# Altium schematic sheet Connectors#1.SchDoc
size A; SheetNumber: 8; SheetTotal: 9
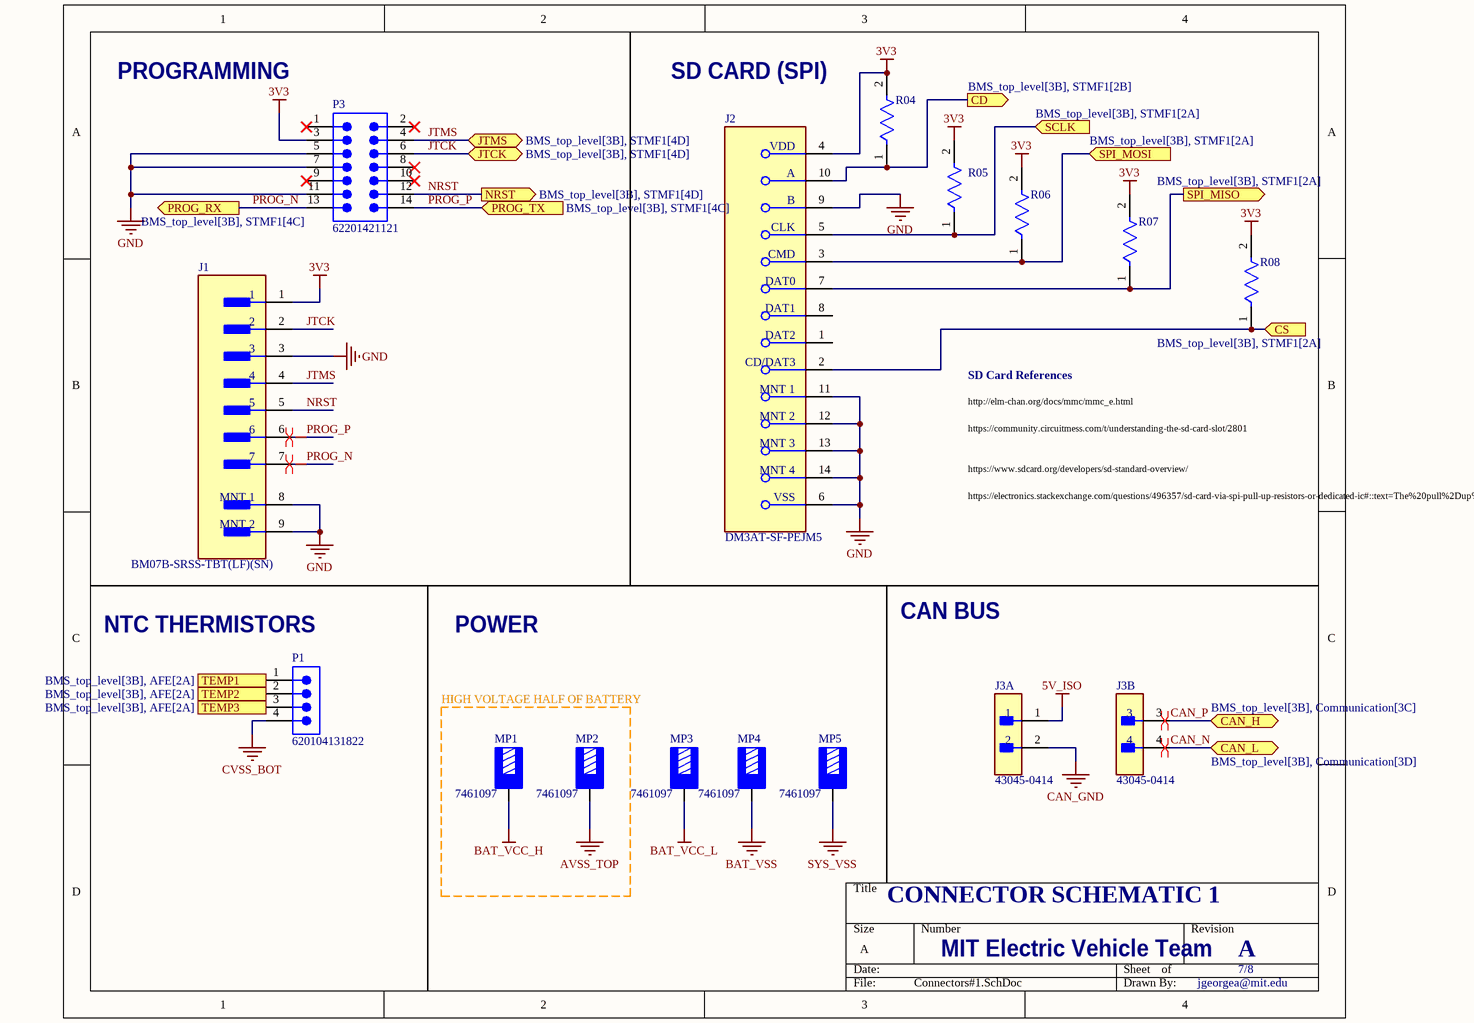
[diagram p0: Connectors#1.SchDoc]

## Parts
J1  BM07B-SRSS-TBT(LF)(SN)  [FP-BM07B-SRSS-TBT_LF_SN-MFG]
J2  DM3AT-SF-PEJM5  [FP-DM3AT-SF-PEJM5-MFG]
J3  43045-0414  [FP-43045-0414-MFG]  (parts A,B of 2)
MP1  7461097  [7461097_chemical surface]
MP2  7461097  [7461097_chemical surface]
MP3  7461097  [7461097_chemical surface]
MP4  7461097  [7461097_chemical surface]
MP5  7461097  [7461097_chemical surface]
P1  620104131822  [620104131822]
P3  62201421121  [62201421121]
R04  RC0603FR-0710KL  [FP-RC0603-0_55-IPC_C]  (value not drawn)
R05  RC0603FR-0710KL  [FP-RC0603-0_55-IPC_C]  (value not drawn)
R06  RC0603FR-0710KL  [FP-RC0603-0_55-IPC_C]  (value not drawn)
R07  RC0603FR-0710KL  [FP-RC0603-0_55-IPC_C]  (value not drawn)
R08  RC0603FR-0710KL  [FP-RC0603-0_55-IPC_C]  (value not drawn)

## Blocks framed on the sheet
HIGH VOLTAGE HALF OF BATTERY: MP1 MP2

## Ports
CAN_H (bidir, see BMS_top_level[3B], Communication[3C]), CAN_L (bidir, see BMS_top_level[3B], Communication[3D]), CD (out, see BMS_top_level[3B], STMF1[2B]), CS (in, see BMS_top_level[3B], STMF1[2A]), JTCK (bidir, see BMS_top_level[3B], STMF1[4D]), JTMS (bidir, see BMS_top_level[3B], STMF1[4D]), NRST (out, see BMS_top_level[3B], STMF1[4D]), PROG_RX (out, see BMS_top_level[3B], STMF1[4C]), PROG_TX (in, see BMS_top_level[3B], STMF1[4C]), SCLK (in, see BMS_top_level[3B], STMF1[2A]), SPI_MISO (out, see BMS_top_level[3B], STMF1[2A]), SPI_MOSI (in, see BMS_top_level[3B], STMF1[2A]), TEMP1 (out, see BMS_top_level[3B], AFE[2A]), TEMP2 (out, see BMS_top_level[3B], AFE[2A]), TEMP3 (out, see BMS_top_level[3B], AFE[2A])

## Nets
3V3: J1.1 J2.4(VDD) P3.3 R04.2 R05.2 R06.2 R07.2 R08.2
5V_ISO: J3.1
AVSS_TOP: MP2.1
BAT_VCC_H: MP1.1
BAT_VCC_L: MP3.1
BAT_VSS: MP4.1
CAN_GND: J3.2
CVSS_BOT: P1.4
GND: J1.3 J1.8(MNT_1) J1.9(MNT_2) J2.6(VSS) J2.9(B) J2.11(MNT_1) J2.12(MNT_2) J2.13(MNT_3) J2.14(MNT_4) P3.5 P3.7 P3.11
SYS_VSS: MP5.1
CAN_N: J3.4 ; port CAN_L
CAN_P: J3.3 ; port CAN_H
CD: J2.10(A) R04.1 ; port CD
CS: J2.2(CD/DAT3) R08.1 ; port CS
JTCK: J1.2 P3.6 ; port JTCK
JTMS: J1.4 P3.4 ; port JTMS
NRST: J1.5 P3.12 ; port NRST
PROG_N: J1.7 P3.13 ; port PROG_RX
PROG_P: J1.6 P3.14 ; port PROG_TX
SCLK: J2.5(CLK) R05.1 ; port SCLK
SPI_MISO: J2.7(DAT0) R07.1 ; port SPI_MISO
SPI_MOSI: J2.3(CMD) R06.1 ; port SPI_MOSI
TEMP1: P1.1 ; port TEMP1
TEMP2: P1.2 ; port TEMP2
TEMP3: P1.3 ; port TEMP3

Not connected (* = marked no-connect by the designer): J2 1(DAT2) 8(DAT1); P3 1* 2* 8* 9* 10*

## Layout directives
differential pair: CAN_N, CAN_P, PROG_N, PROG_P

## Notes on the sheet
- PROGRAMMING
- SD CARD (SPI)
- http://elm-chan.org/docs/mmc/mmc_e.html
- SD Card References
- https://community.circuitmess.com/t/understanding-the-sd-card-slot/2801
- https://www.sdcard.org/developers/sd-standard-overview/
- https://electronics.stackexchange.com/questions/496357/sd-card-via-spi-pull-up-resistors-or-dedicated-ic#::text=The%20pull%2Dup%20resistors%20are,the%20SD%20card%20(MISO.)
- (near P1) NTC THERMISTORS
- POWER
- CAN BUS
- CONNECTOR SCHEMATIC 1
- MIT Electric Vehicle Team
- A
- 7/8
- jgeorgea@mit.edu

## Library data of the parts
J1 = CMP-17439-000654-1: Connector Header Surface Mount 7 position 0.039" (1.00mm); Max Voltage Rating (AC): 50V; Max Current Rating: 1A; Contact Resistance: 40mR; Pitch: 1mm; Number of Positions: 7; Contact Material: Copper Alloy; Depth: 2.9mm; Contact Plating: Copper; Orientation: Straight; Termination: Solder; Max Operating Temperature: 85°C; Lead Free: Lead Free; Housing Material: Polyamide; Number of Rows: 1; Housing Color: Beige; Length: 9mm; Min Operating Temperature: -25°C; Packaging: Tape and Reel
J2 = CMP-2000-05150-2: CONN MICRO SD CARD PUSH-PUSH R/A; Current Rating: 500mA; Number of Contacts: 8; Pitch: 1.1mm; Gender: Female; Connector Type: Connector; Max Voltage Rating (AC): 125V; Min Operating Temperature: -25°C; Length: 15.95mm; Packaging: Tape and Reel; Width: 13.85mm; Flammability Rating: UL94 V-0; Termination: SMD/SMT; Contact Material: Copper Alloy; Depth: 15.95mm; Radiation Hardening: No; Number of Rows: 1; Max Operating Temperature: 85°C; Housing Material: Polymer; Height: 1.68mm; Package Quantity: 1; Orientation: Right Angle; REACH SVHC: No SVHC; Mount: Surface Mount; Max Current Rating: 500mA; Number of Positions: 8; Lead Free: Lead Free; Contact Plating: Gold; Voltage Rating: 125V
J3 = CMP-04776-000520-1: CONN HEADER VERT 4POS 3MM; Approvals: UL; Current Rating: 5A; Insulation Resistance: 1GR; Max Voltage Rating (DC): 250.25kV; Gender: Male; Number of Positions: 4; Glow Wire Compliant: Compliant; Voltage Rating: 600V; Contact Resistance: 10mR; Voltage Rating (DC): 250V; Pitch: 3mm; Halogen Free: Low Halogen; Flammability Rating: UL94 V-0; Max Current Rating: 5A; Contact Material: Brass; Case/Package: 0414; Contact Plating: Gold; Number of Rows: 2; Number of Contacts: 4; Diameter: 3mm; Depth: 8.77mm; Row Spacing: 3mm; Housing Color: Black; Termination: Solder; Package Quantity: 2232; Max Operating Temperature: 105°C; Number of Circuits: 4; Lead Free: Lead Free; Color: Black; Orientation: Vertical; Height: 9.91mm; Series: 43045; Packaging: Tray; Mount: Through Hole; Length: 10.15mm; Min Operating Temperature: -40°C; Housing Material: Thermoplastic; REACH SVHC: No SVHC
MP1-MP5 = CMP-03913-18187405-1: 7461097 16 Pin Power Element, Copper Zinc Alloy, 240A, M6, Vertical; Current Rating: 180A; Insulation: Non-Insulated; Number of Contacts: 16; Thread Size: M6; Number of Pins: 16; Mount: Through Hole; Packaging: Bulk; REACH SVHC: Unknown; Max Operating Temperature: 150°C; Contact Plating: Tin; Width: 10mm; Material: Brass; Length: 10mm; Height: 14mm; Min Operating Temperature: -55°C; Contact Material: Copper; Termination: Press-Fit; NexarPartId: 18187405; RoHS: Compliant
P1 = CMP-1502-00671-2: NexarPartId: 18818240; Number of Positions: 4; Operating Supply Voltage: 100V; Connector Type: Male Pin; Insulation: Insulated; Pitch: 2mm; Insulation Resistance: 1GΩ; Contact Resistance: 20mΩ; Voltage Rating: 125V; Current Rating: 2A; Gender: Male; Width: 12mm; Flammability Rating: UL94 V-0; Contact Gender: Male; REACH SVHC: Unknown; Packaging: Tape and Reel; Contact Plating: Tin; Termination: SMD/SMT; Number of Rows: 1; Mount: Surface Mount; Contact Mating Length: 3.683mm; Lead Free: Lead Free; Housing Material: Nylon; Number of Contacts: 4; RoHS: Compliant; Min Operating Temperature: -40°C; Number of Pins: 4; Length: 12mm; Height: 5.6mm; Max Operating Temperature: 85°C; Color: Beige, White; Contact Material: Copper; Lead Pitch: 2mm
P3 = CMP-1502-00949-2: NexarPartId: 32855587; Current Rating: 1A; Row Spacing: 1.27mm; Connector Type: Male Pin; Number of Contacts: 14; Contact Resistance: 20mΩ; Gender: Male; Operating Supply Voltage: 100V; Contact Mating Length: 3.81mm; REACH SVHC: Unknown; Lead Pitch: 1.27mm; Packaging: Box; Contact Material: Copper; Color: Black; Orientation: Vertical; Termination: Solder; Number of Positions: 14; Contact Plating: Gold; Number of Rows: 2; RoHS: Compliant; Mount: Through Hole; Number of Pins: 14; Pitch: 1.27mm
R04 R05 R06 R07 R08 = CMP-2100-03664-2: RES 10K OHM 1% 1/10W 0603; Voltage Rating: 75V; Voltage Rating (DC): 50V; Resistance: 10kR; Power Rating: 100mW; Temperature Coefficient: 100ppm/°C; Depth: 0.8mm; Termination: SMD/SMT; Resistor Type: Thick Film; Series: RC; Construction: Rectangular; Features: Moisture Resistant; Packaging: Tape and Reel; Min Operating Temperature: -55°C; Number of Terminations: 2; Lead Pitch: 0.3mm; RoHS Compliant: Yes; Case/Package: 0603; Resistance Tolerance: 1%; Military Standard: Not; Weight: 7.1E-05oz; Number of Pins: 2; Tolerance: 1%; Length: 1.6mm; Case Code (Imperial): 0603; Lead Free: Lead Free; Width: 0.8mm; Max Power Dissipation: 100mW; Height: 0.45mm; Max Operating Temperature: 155°C; Case Code (Metric): 1608; Size Code: 0603